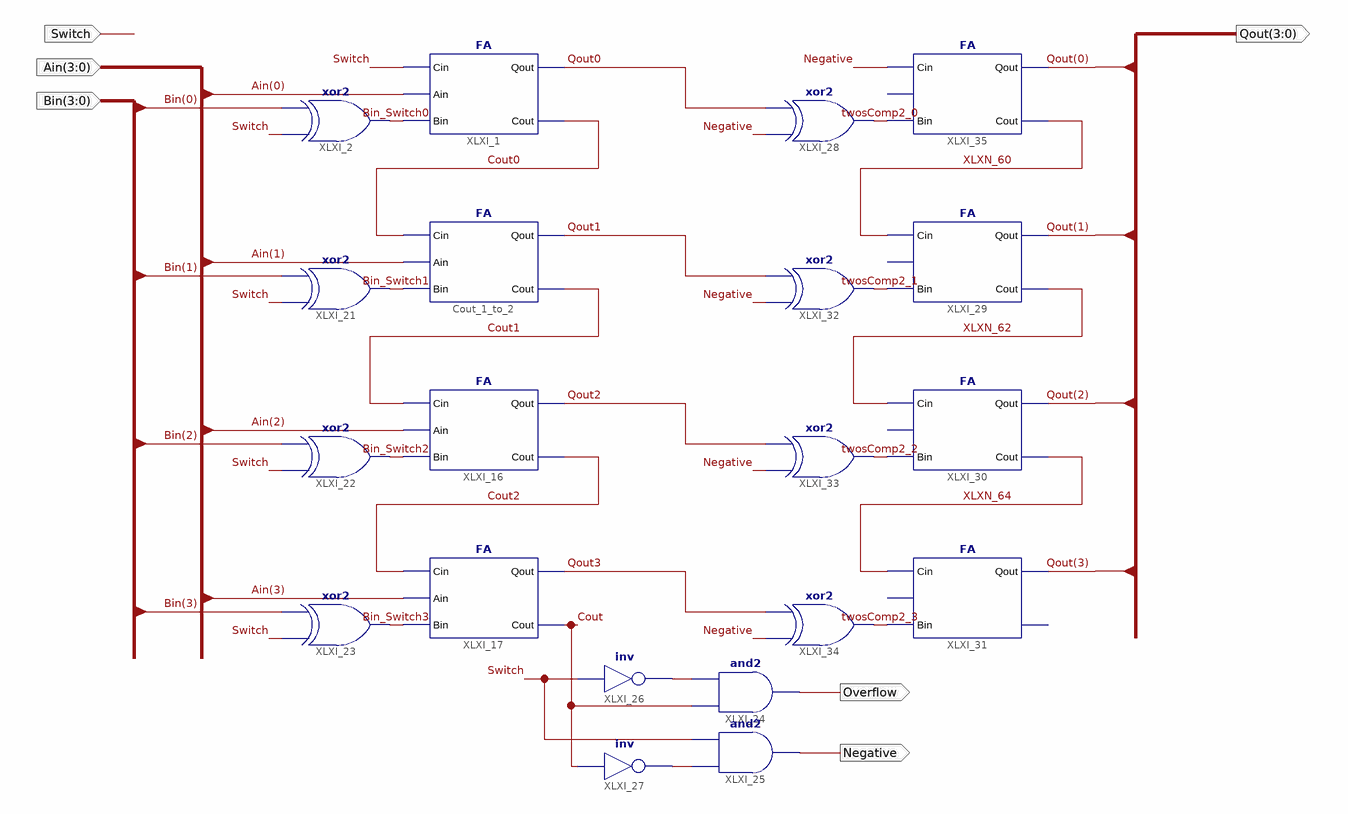
[diagram p0: schematic sheet 1]
// Xilinx ISE schematic Lab5_Ex3.sch (spartan3e) as structural Verilog: 20 symbols, 6 ports
module Lab5_Ex3 (
  input  [3:0] Bin,
  input  [3:0] Ain,
  input  Switch,
  output Overflow,
  output Negative,
  output [3:0] Qout
);

  wire Bin_Switch0, Bin_Switch1, Bin_Switch2, Bin_Switch3, Cout, Cout0, Cout1, Cout2, Qout0, Qout1, Qout2,
       Qout3, twosComp2_0, twosComp2_1, twosComp2_2, twosComp2_3, XLXN_46, XLXN_49, XLXN_60, XLXN_62, XLXN_64;

  FA XLXI_1 (.Cin(Switch), .Ain(Ain[0]), .Bin(Bin_Switch0), .Qout(Qout0), .Cout(Cout0));
  xor XLXI_2 (Bin_Switch0, Switch, Bin[0]);
  FA Cout_1_to_2 (.Cin(Cout0), .Ain(Ain[1]), .Bin(Bin_Switch1), .Qout(Qout1), .Cout(Cout1));
  FA XLXI_16 (.Cin(Cout1), .Ain(Ain[2]), .Bin(Bin_Switch2), .Qout(Qout2), .Cout(Cout2));
  FA XLXI_17 (.Cin(Cout2), .Ain(Ain[3]), .Bin(Bin_Switch3), .Qout(Qout3), .Cout(Cout));
  xor XLXI_21 (Bin_Switch1, Switch, Bin[1]);
  xor XLXI_22 (Bin_Switch2, Switch, Bin[2]);
  xor XLXI_23 (Bin_Switch3, Switch, Bin[3]);
  and XLXI_24 (Overflow, Cout, XLXN_46);
  and XLXI_25 (Negative, XLXN_49, Switch);
  not XLXI_26 (XLXN_46, Switch);
  not XLXI_27 (XLXN_49, Cout);
  xor XLXI_28 (twosComp2_0, Negative, Qout0);
  FA XLXI_29 (.Cin(XLXN_60), .Bin(twosComp2_1), .Qout(Qout[1]), .Cout(XLXN_62));  // open: Ain
  FA XLXI_30 (.Cin(XLXN_62), .Bin(twosComp2_2), .Qout(Qout[2]), .Cout(XLXN_64));  // open: Ain
  FA XLXI_31 (.Cin(XLXN_64), .Bin(twosComp2_3), .Qout(Qout[3]));  // open: Ain, Cout
  xor XLXI_32 (twosComp2_1, Negative, Qout1);
  xor XLXI_33 (twosComp2_2, Negative, Qout2);
  xor XLXI_34 (twosComp2_3, Negative, Qout3);
  FA XLXI_35 (.Cin(Negative), .Bin(twosComp2_0), .Qout(Qout[0]), .Cout(XLXN_60));  // open: Ain
endmodule
